# Altium schematic sheet Audio_Amplifier.SchDoc
size A; SheetNumber: 1; SheetTotal: 1
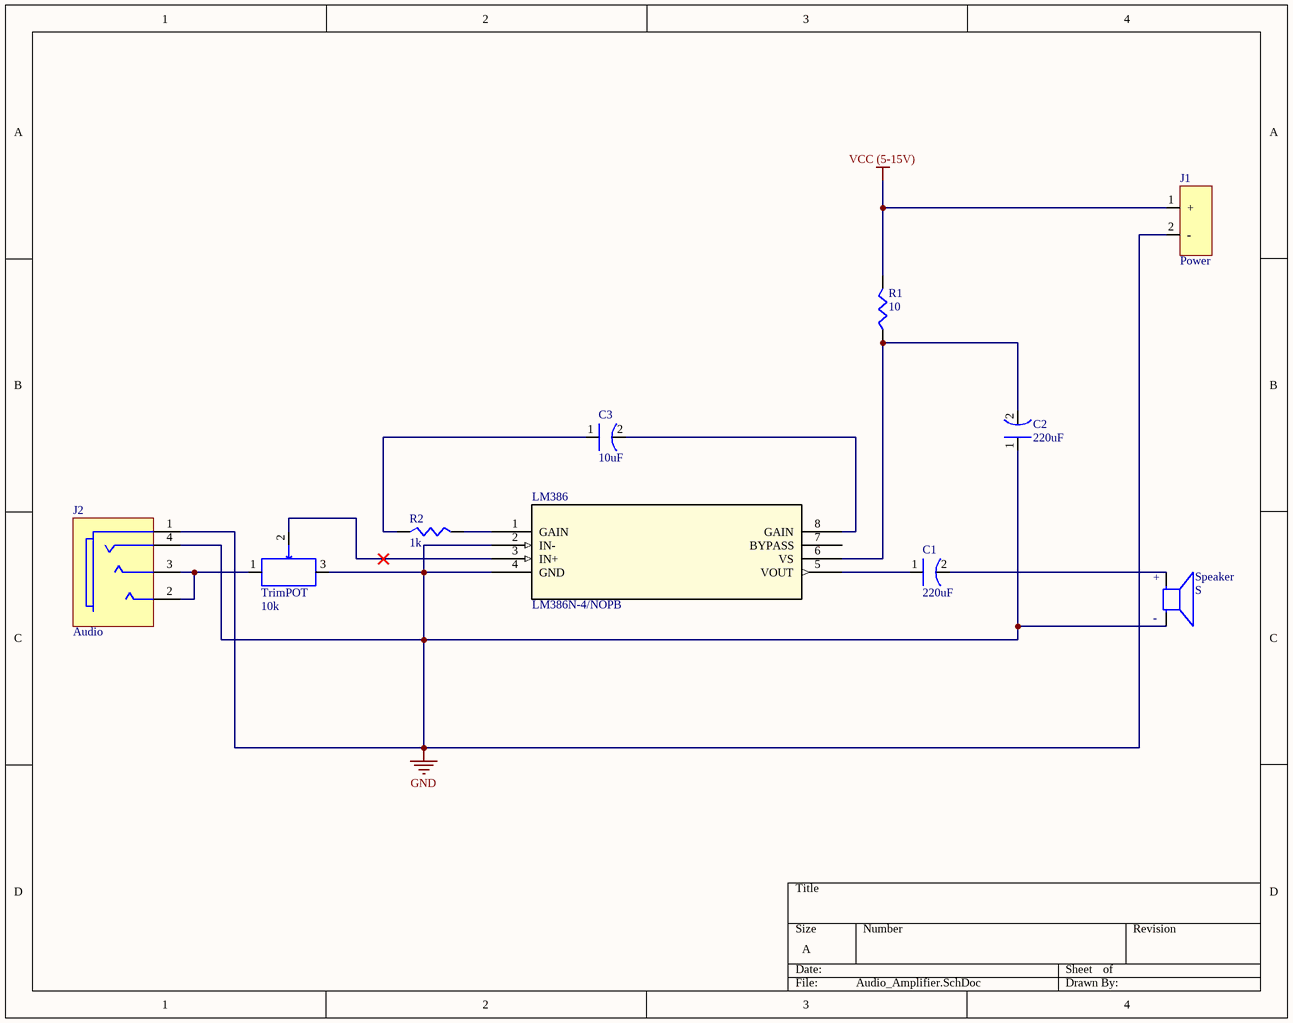
[diagram p0: Audio_Amplifier.SchDoc]

## Parts
C1  220uF  [CAP_YX_6P3X11_RUB]
C2  220uF  [CAP_YX_6P3X11_RUB]
C3  10uF  [CAP_YX_5X11_RUB]
J1  Power  [TE_2314870-2]
J2  Audio  [SAMESKY_SJ2-3574A-SMT-TR]
LM386  LM386N-4/NOPB  [N08E_TEX]
R1  10  [RES_OY_OHM]
R2  1k  [STA_CF14_STP]
Speaker  S  [SPKR_AST-03208MR-R]
TrimPOT  10k  [TRIM_3362P-1-103LF]

## Nets
GND: C2.1 J1.2(-) J2.1(sleeve) J2.4(ring_2) LM386.2(IN-) LM386.4(GND) Speaker.N(NEG) TrimPOT.3
VCC (5-15V): J1.1(+) R1.2
NetC1_1: C1.1 LM386.5(VOUT)
NetC1_2: C1.2 Speaker.P(POS)
NetC2_2: C2.2 LM386.6(VS) R1.1
NetC3_1: C3.1 R2.1
NetC3_2: C3.2 LM386.8(GAIN)
NetJ2_2: J2.2(tip) J2.3(ring_1) TrimPOT.1
NetLM386_1: LM386.1(GAIN) R2.2
NetLM386_3: LM386.3(IN+) TrimPOT.2

Not connected (* = marked no-connect by the designer): LM386 7(BYPASS)

## Notes on the sheet
- (in symbol AST-03208MR-R) +; -

## Library data of the parts
C1 C2 = 25YXJ220M6.3X11: CAP ALUM 220UF 20% 25V RADIAL TH; Manufacturer: Rubycon; Value: 220µF; Impedance: 220mΩ; Lead Diameter: 500µm; Leakage Current: 55µA; Life (Hours): 7000hours; Polarity: Polar; Ripple Current: 280mA; Supplier: DigiKey; Supplier Part Number: 1189-2913-ND; Manufacturer Part Number: 25YXJ220M6.3X11; RoHS: Compliant; Category: Aluminum Electrolytic Capacitors; Stock: 49998; Pricing: 1=0.3, 10=0.136, 50=0.1348, 100=0.1186, 500=0.09074, 2000=0.07456, 4000=0.06845, 6000=0.06536 (USD); Case/Package: Radial; Diameter: 6.3mm; Height: 11mm; Height - Seated (Max): 12.4968mm; Lead Pitch: 2.5mm; Length: 11mm; Lifecycle Status: Production; Max Operating Temperature: 105°C; Min Operating Temperature: -40°C; Mounting Technology: Through Hole; Number of Terminals: 2; Packaging: Bulk; Radiation Hardening: No; REACH SVHC: Yes; Terminal Pitch: 2.5mm; Termination: Radial; Tolerance: 20%; Voltage: 25V; Voltage Rating: 25V; Voltage Rating (DC): 25V; ComponentLink1URL: https://datasheet.octopart.com:443/25YXJ220M6.3X11-Rubycon-datasheet-182101243.pdf?src-supplier=IHS; ComponentLink1Description: https://datasheet.octopart.com:443/25YXJ220M6.3X11-Rubycon-datasheet-182101243.pdf?src-supplier=IHS; ComponentLink2URL: https://datasheet.octopart.com:443/25YXJ220M6.3X11-Rubycon-datasheet-86451563.pdf?src-supplier=Master+Electronics; ComponentLink2Description: https://datasheet.octopart.com:443/25YXJ220M6.3X11-Rubycon-datasheet-86451563.pdf?src-supplier=Master+Electronics; ComponentLink3URL: https://datasheet.octopart.com:443/25YXJ220M6.3X11-Rubycon-datasheet-155906921.pdf?src-supplier=JRH+Electronics; ComponentLink3Description: https://datasheet.octopart.com:443/25YXJ220M6.3X11-Rubycon-datasheet-155906921.pdf?src-supplier=JRH+Electronics; ComponentLink4URL: https://datasheet.octopart.com:443/25YXJ220M6.3X11-Rubycon-datasheet-12363446.pdf?src-supplier=Future+Electronics; ComponentLink4Description: https://datasheet.octopart.com:443/25YXJ220M6.3X11-Rubycon-datasheet-12363446.pdf?src-supplier=Future+Electronics
C3 = 50YXJ10M5X11: CAP ALUM 10UF 20% 50V RADIAL TH; Manufacturer: Rubycon; Value: 10µF; Impedance: 1.5Ω; Leakage Current: 5µA; Life (Hours): 5000hours; Ripple Current: 42mA; Supplier: DigiKey; Supplier Part Number: 1189-2322-ND; Manufacturer Part Number: 50YXJ10M5X11; RoHS: Compliant; Category: Aluminum Electrolytic Capacitors; Stock: 46663; Pricing: 1=0.29, 10=0.131, 50=0.1296, 100=0.1141, 500=0.08714, 1000=0.07859, 3000=0.0679, 6000=0.06259 (USD); Case/Package: Radial; Diameter: 5mm; Height: 11mm; Height - Seated (Max): 12.4968mm; Lead Free: Lead Free; Lead Pitch: 2.0066mm; Length: 11mm; Lifecycle Status: Production; Max Operating Temperature: 105°C; Min Operating Temperature: -40°C; Mounting Technology: Through Hole; Number of Terminals: 2; Packaging: Bulk; Radiation Hardening: No; REACH SVHC: Yes; Terminal Pitch: 2mm; Termination: Radial; Tolerance: 20%; Voltage Rating: 50V; Voltage Rating (DC): 50V; ComponentLink1URL: https://datasheet.octopart.com:443/50YXJ10M5X11-Rubycon-datasheet-182101243.pdf?src-supplier=IHS; ComponentLink1Description: https://datasheet.octopart.com:443/50YXJ10M5X11-Rubycon-datasheet-182101243.pdf?src-supplier=IHS; ComponentLink2URL: https://datasheet.octopart.com:443/50YXJ10M5X11-Rubycon-datasheet-12363446.pdf?src-supplier=Master+Electronics; ComponentLink2Description: https://datasheet.octopart.com:443/50YXJ10M5X11-Rubycon-datasheet-12363446.pdf?src-supplier=Master+Electronics; ComponentLink3URL: https://datasheet.octopart.com:443/50YXJ10M5X11-Rubycon-datasheet-155906921.pdf?src-supplier=JRH+Electronics; ComponentLink3Description: https://datasheet.octopart.com:443/50YXJ10M5X11-Rubycon-datasheet-155906921.pdf?src-supplier=JRH+Electronics
J1 = 2314870-2: 2P,2MM,BB,REC,SRVT,2.0,0.76AU,TU; Manufacturer: TE Connectivity / AMP; Circuit Application: Signal; Contact Current Rating: 2A; Contact Style: Socket; Dielectric Material: Liquid Crystal Polymer; Insulation Resistance: 1GΩ; Mating Alignment: Without; Number of Contacts: 2; Number of Ports: 1; Operating Supply Voltage: 125V; PCB Thickness: 1.6mm; Plating Thickness: 759.99848nm; Shielding: No; Supplier: DigiKey; Supplier Part Number: 17-2314870-2-ND; Manufacturer Part Number: 2314870-2; RoHS: Compliant; Category: Card Edge Connectors; Stock: 11381; Pricing: 1=0.72, 10=0.609, 110=0.51427, 550=0.45902, 1100=0.4371, 5060=0.39248, 10010=0.37405 (USD); China RoHS: Compliant; Contact Finish Thickness - Mating: 760nm; Contact Gender: Female; Current Rating: 2A; Housing Color: Black; Length: 4mm; Lifecycle Status: Production; Max Operating Temperature: 125°C; Min Operating Temperature: -40°C; Pins: 2; Number of Positions: 2; Number of Rows: 1; Orientation: Vertical; PCB Mount Alignment: Without; PCB Mount Retention: Without; REACH SVHC: Yes; Terminal Pitch: 2mm; Width: 2mm; ComponentLink1URL: https://datasheet.octopart.com:443/2314870-2-TE-Connectivity-datasheet-180034179.pdf?src-supplier=IHS; ComponentLink1Description: https://datasheet.octopart.com:443/2314870-2-TE-Connectivity-datasheet-180034179.pdf?src-supplier=IHS; ComponentLink2URL: https://datasheet.octopart.com:443/2314870-2-TE-Connectivity---AMP-datasheet-137291475.pdf?src-supplier=TE+Connectivity; ComponentLink2Description: https://datasheet.octopart.com:443/2314870-2-TE-Connectivity---AMP-datasheet-137291475.pdf?src-supplier=TE+Connectivity; ComponentLink3URL: https://sigma.octopart.com:443/137815737/technical_drawing/TE-Connectivity-2314870-2.pdf?src-supplier=TE+Connectivity; ComponentLink3Description: https://sigma.octopart.com:443/137815737/technical_drawing/TE-Connectivity-2314870-2.pdf?src-supplier=TE+Connectivity; ComponentLink4URL: https://datasheet.octopart.com:443/2314870-2-TE-Connectivity---AMP-datasheet-170291846.pdf?src-supplier=Master+Electronics; ComponentLink4Description: https://datasheet.octopart.com:443/2314870-2-TE-Connectivity---AMP-datasheet-170291846.pdf?src-supplier=Master+Electronics; ComponentLink5URL: https://datasheet.octopart.com:443/2314870-2-TE-Connectivity-datasheet-181565101.pdf?src-supplier=Sager+Electronics; ComponentLink5Description: https://datasheet.octopart.com:443/2314870-2-TE-Connectivity-datasheet-181565101.pdf?src-supplier=Sager+Electronics
J2 = SJ2-3574A-SMT-TR: AUDIO JACK, 3.5 MM, RT, 4 CONDUC; Manufacturer: CUI; Conn Orientation: Horizontal; Current Rating: 1A; Number Of Contacts: 4; Voltage Rating: 12V; Package: SJ2-3574A-SMT-TR; Device Class L1: Connectors; Lead Free: Yes; Digikey Description: AUDIO JACK, 3.5 MM, RT, 4 CONDUC; Device Class L2: Audio / Video Connectors; ComponentLink2URL: https://www.cui.com/product/resource/sj2-357x-smt.pdf; Automotive: No; RoHS: TRUE; Height: 5.3mm; Temperature Range Low: -25°C; Category: Conn; Temperature: -25°C to +85°C; Octopart: https://octopart.com/sj2-3574a-smt-tr-cui-77838840; Device Class L3: unset; Contact Material: Silver; Manufacturer Part Number: SJ2-3574A-SMT-TR; Temperature Range High: +85°C; ComponentLink2Description: Datasheet
LM386 = LM386N-4/NOPB: IC AMP CLASS AB MONO 1W 8DIP; Manufacturer: Texas Instruments; Manufacturer Lifecycle Status: ACTIVE; Bandwidth: 300kHz; Gain: 20dB; Input Bias Current: 250nA; Load Impedance: 8Ω; Max Power Dissipation: 1.25W; Max Supply Voltage: 18V; Min Supply Voltage: 5V; Nominal Supply Current: 4mA; Number of Channels: 1; Operating Supply Voltage: 12V; Power Supply Rejection Ratio (PSRR): 50dB; Supply Type: Single; Voltage Gain: 46dB; Supplier: DigiKey; Supplier Part Number: 296-43960-5-ND; Manufacturer Part Number: LM386N-4/NOPB; RoHS: Compliant; Category: Amplifiers - Audio; Stock: 3854; Pricing: 1=1.05, 10=0.757, 40=0.6525, 120=0.59425, 280=0.56014, 520=0.53985, 1000=0.52192, 2520=0.5016, 5000=0.48959 (USD); Case/Package: PDIP; Contact Plating: Tin; Height: 5.08mm; Lead Free: Lead Free; Length: 9.81mm; Lifecycle Status: Production; Max Operating Temperature: 70°C; Max Output Power: 1W; Min Operating Temperature: 0°C; Pins: 8; Output Power: 1W; Power Dissipation: 1.25W; Quiescent Current: 4mA; Radiation Hardening: No; REACH SVHC: No; Schedule B: 8542330000, 8542330000|8542330000|8542330000|8542330000|8542330000; Thickness: 3.9mm; Weight: 4.535924g; Width: 6.35mm; ComponentLink1URL: https://octopart.com:443/opatz8j6/c1?t=jiPaMZP2rnyQg5DzUUspGXJ1H81nn_meodlJxaU5rnmp5Nz2ANkFOJjw4AMPM17dABOurUYLs7Oiea1cG9Dp3V3kRsJ43gYboc5MRNM_wXx_hdbyhUPu1cwRkgSQnbMDrTSRuBGe7vuZ52zUPxv4RYMfxCTIfcL-Gs1LHG8EJfKQca_ABSS6-7HJh27p74ambnRZQ_xhmEf-5hRXq6kXlRxXTde8jlB9apxAIESCEWDl4004FjcawcWp2VDcw49HMZT9NKZB0TSbyNArSrQo-COYzUjjGeFKa-94cvLja9jANuMpPI5KLd_4xSjywMOucovxXtGr6NT1M1bIYcylWYcDOz6hqSDLVAehd2HyIxJaoHqn7yOvszgqGYrjaQdrIEmJ&src-supplier=Texas+Instruments; ComponentLink1Description: https://octopart.com:443/opatz8j6/c1?t=jiPaMZP2rnyQg5DzUUspGXJ1H81nn_meodlJxaU5rnmp5Nz2ANkFOJjw4AMPM17dABOurUYLs7Oiea1cG9Dp3V3kRsJ43gYboc5MRNM_wXx_hdbyhUPu1cwRkgSQnbMDrTSRuBGe7vuZ52zUPxv4RYMfxCTIfcL-Gs1LHG8EJfKQca_ABSS6-7HJh27p74ambnRZQ_xhmEf-5hRXq6kXlRxXTde8jlB9apxAIESCEWDl4004FjcawcWp2VDcw49HMZT9NKZB0TSbyNArSrQo-COYzUjjGeFKa-94cvLja9jANuMpPI5KLd_4xSjywMOucovxXtGr6NT1M1bIYcylWYcDOz6hqSDLVAehd2HyIxJaoHqn7yOvszgqGYrjaQdrIEmJ&src-supplier=Texas+Instruments; ComponentLink2URL: https://sigma.octopart.com:443/49250158/technical_drawing/Texas-Instruments-LM386N-4-NOPB.pdf?src-supplier=Texas+Instruments; ComponentLink2Description: https://sigma.octopart.com:443/49250158/technical_drawing/Texas-Instruments-LM386N-4-NOPB.pdf?src-supplier=Texas+Instruments; ComponentLink3URL: https://datasheet.octopart.com:443/LM386N-4-NOPB-Texas-Instruments-datasheet-94062099.pdf?src-supplier=Upverter; ComponentLink3Description: https://datasheet.octopart.com:443/LM386N-4-NOPB-Texas-Instruments-datasheet-94062099.pdf?src-supplier=Upverter; ComponentLink4URL: https://datasheet.octopart.com:443/LM386N-4/NOPB-Texas-Instruments-datasheet-10848518.pdf?src-supplier=element14; ComponentLink4Description: https://datasheet.octopart.com:443/LM386N-4/NOPB-Texas-Instruments-datasheet-10848518.pdf?src-supplier=element14; ComponentLink5URL: https://datasheet.octopart.com:443/LM386N-4/NOPB-National-Semiconductor-datasheet-11093.pdf?src-supplier=element14; ComponentLink5Description: https://datasheet.octopart.com:443/LM386N-4/NOPB-National-Semiconductor-datasheet-11093.pdf?src-supplier=element14; ComponentLink6URL: https://datasheet.octopart.com:443/LM386N-4-NOPB-Texas-Instruments-datasheet-164415079.pdf?src-supplier=SHENGYU+ELECTRONICS; ComponentLink6Description: https://datasheet.octopart.com:443/LM386N-4-NOPB-Texas-Instruments-datasheet-164415079.pdf?src-supplier=SHENGYU+ELECTRONICS; ComponentLink7URL: https://datasheet.octopart.com:443/LM386N-4-NOPB-Texas-Instruments-datasheet-159115206.pdf?src-supplier=LCSC; ComponentLink7Description: https://datasheet.octopart.com:443/LM386N-4-NOPB-Texas-Instruments-datasheet-159115206.pdf?src-supplier=LCSC; ComponentLink8URL: https://datasheet.octopart.com:443/LM386N-4/NOPB-National-Semiconductor-datasheet-9929271.pdf?src-supplier=RS+(Formerly+Allied+Electronics); ComponentLink8Description: https://datasheet.octopart.com:443/LM386N-4/NOPB-National-Semiconductor-datasheet-9929271.pdf?src-supplier=RS+(Formerly+Allied+Electronics); ComponentLink9URL: https://datasheet.octopart.com:443/LM386N-4-NOPB-Texas-Instruments-datasheet-8817787.pdf?src-supplier=Jameco; ComponentLink9Description: https://datasheet.octopart.com:443/LM386N-4-NOPB-Texas-Instruments-datasheet-8817787.pdf?src-supplier=Jameco; ComponentLink10URL: http://sigma.octopart.com:80/conflict_mineral_statement/Texas-Instruments-company-63.pdf?src-supplier=Compliance+Statements; ComponentLink10Description: http://sigma.octopart.com:80/conflict_mineral_statement/Texas-Instruments-company-63.pdf?src-supplier=Compliance+Statements; ComponentLink11URL: http://sigma.octopart.com:80/reach_statement/Texas-Instruments-company-64.pdf?src-supplier=Compliance+Statements; ComponentLink11Description: http://sigma.octopart.com:80/reach_statement/Texas-Instruments-company-64.pdf?src-supplier=Compliance+Statements
R1 = OY100KE: RES 10 OHM 10% 2W AXIAL; Manufacturer: Ohmite; Lead Diameter: 800µm; Lead Length: 38mm; Value: 10Ω; Temperature Coefficient: 1600ppm/°C; Voltage Rating: 400V; Wire/Cable Diameter: 787.4µm; Supplier: DigiKey; Supplier Part Number: OY100KE-ND; Manufacturer Part Number: OY100KE; RoHS: Compliant; Category: Through-Hole Resistors; Stock: 6509; Pricing: 1=3.32, 10=2.226, 25=1.9292, 50=1.7438, 100=1.5859, 250=1.41308, 500=1.30492, 1000=1.21304, 5000=1.04961 (USD); Case/Package: Axial; Composition: Ceramic; Diameter: 7mm; Features: Moisture Resistant; Lead Free: Lead Free; Length: 18.9992mm; Lifecycle Status: Production; Material: Ceramic; Max Operating Temperature: 220°C; Max Power Dissipation: 2W; Min Operating Temperature: -40°C; Mounting Technology: Through Hole; Pins: 2; Number of Terminals: 2; Number of Terminations: 2; Packaging: Bulk; Power Dissipation: 2W; Power Rating: 2W; REACH SVHC: Yes; Termination: Axial; Tolerance: 10%; Voltage Rating (AC): 400V; Voltage Rating (DC): 400V; Working Voltage: 400V; ComponentLink1URL: https://datasheet.octopart.com:443/OY100KE-Ohmite-datasheet-10289479.pdf?src-supplier=Master+Electronics; ComponentLink1Description: https://datasheet.octopart.com:443/OY100KE-Ohmite-datasheet-10289479.pdf?src-supplier=Master+Electronics; ComponentLink2URL: https://datasheet.octopart.com:443/OY100KE-Ohmite-datasheet-118803.pdf?src-supplier=Newark; ComponentLink2Description: https://datasheet.octopart.com:443/OY100KE-Ohmite-datasheet-118803.pdf?src-supplier=Newark; ComponentLink3URL: https://datasheet.octopart.com:443/OY100KE-Ohmite-datasheet-8757895.pdf?src-supplier=Newark; ComponentLink3Description: https://datasheet.octopart.com:443/OY100KE-Ohmite-datasheet-8757895.pdf?src-supplier=Newark; ComponentLink4URL: https://datasheet.octopart.com:443/OY100KE-Ohmite-datasheet-8449861.pdf?src-supplier=Newark; ComponentLink4Description: https://datasheet.octopart.com:443/OY100KE-Ohmite-datasheet-8449861.pdf?src-supplier=Newark; ComponentLink5URL: https://datasheet.octopart.com:443/OY100KE-Ohmite-datasheet-65987458.pdf?src-supplier=Electro+Sonic; ComponentLink5Description: https://datasheet.octopart.com:443/OY100KE-Ohmite-datasheet-65987458.pdf?src-supplier=Electro+Sonic; ComponentLink6URL: https://datasheet.octopart.com:443/OY100KE-Ohmite-datasheet-156071680.pdf?src-supplier=Electro+Sonic; ComponentLink6Description: https://datasheet.octopart.com:443/OY100KE-Ohmite-datasheet-156071680.pdf?src-supplier=Electro+Sonic; ComponentLink7URL: https://datasheet.octopart.com:443/OY100KE-Ohmite-datasheet-27849301.pdf?src-supplier=Electro+Sonic; ComponentLink7Description: https://datasheet.octopart.com:443/OY100KE-Ohmite-datasheet-27849301.pdf?src-supplier=Electro+Sonic; ComponentLink8URL: https://datasheet.octopart.com:443/OY100KE-Ohmite-datasheet-37140018.pdf?src-supplier=Farnell; ComponentLink8Description: https://datasheet.octopart.com:443/OY100KE-Ohmite-datasheet-37140018.pdf?src-supplier=Farnell; ComponentLink9URL: https://datasheet.octopart.com:443/OY100KE-Ohmite-datasheet-3744.pdf?src-supplier=RS+(Formerly+Allied+Electronics); ComponentLink9Description: https://datasheet.octopart.com:443/OY100KE-Ohmite-datasheet-3744.pdf?src-supplier=RS+(Formerly+Allied+Electronics)
R2 = CF14JT1K00: RES 1K OHM 5% 1/4W AXIAL; Manufacturer: Stackpole Electronics; Lead Diameter: 550µm; Lead Length: 28mm; Max Power Dissipation: 250mW; Value: 1kΩ; Temperature Coefficient: -400ppm/°C; Working Voltage: 350V; Supplier: DigiKey; Supplier Part Number: CF14JT1K00CT-ND; Manufacturer Part Number: CF14JT1K00; RoHS: Compliant; Category: Through-Hole Resistors; Stock: 403693; Pricing: 1=0.1, 10=0.026, 25=0.022, 50=0.0192, 100=0.0169, 250=0.01424, 500=0.0126, 1000=0.0112 (USD); Case/Package: Axial; China RoHS: Compliant; Composition: Carbon Film; Contact Plating: Tin; Diameter: 2.3mm; Features: Flame Retardant Coating; Lead Free: Lead Free; Length: 6.5mm; Lifecycle Status: Production; Max Operating Temperature: 155°C; Military Standard: Not; Min Operating Temperature: -55°C; Mounting Technology: Axial, Through Hole; Number of Terminals: 2; Number of Terminations: 2; Packaging: Tape & Reel (TR); Power Dissipation: 250mW; Power Rating: 250mW; Radiation Hardening: No; REACH SVHC: Yes; Schedule B: 8533100070, 8533100070|8533100070|8533100070|8533100070|8533100070; Termination: Axial; Tolerance: 5%; ComponentLink1URL: https://datasheet.octopart.com:443/CF14JT1K00-Stackpole-Electronics-datasheet-170576565.pdf?src-supplier=IHS; ComponentLink1Description: https://datasheet.octopart.com:443/CF14JT1K00-Stackpole-Electronics-datasheet-170576565.pdf?src-supplier=IHS; ComponentLink2URL: https://datasheet.octopart.com:443/CF14JT1K00-Stackpole-Electronics-datasheet-32780772.pdf?src-supplier=Electro+Sonic; ComponentLink2Description: https://datasheet.octopart.com:443/CF14JT1K00-Stackpole-Electronics-datasheet-32780772.pdf?src-supplier=Electro+Sonic; ComponentLink3URL: https://datasheet.octopart.com:443/CF14JT1K00-Stackpole-Electronics-datasheet-141193785.pdf?src-supplier=Upverter; ComponentLink3Description: https://datasheet.octopart.com:443/CF14JT1K00-Stackpole-Electronics-datasheet-141193785.pdf?src-supplier=Upverter; ComponentLink4URL: https://datasheet.octopart.com:443/CF14JT1K00-Stackpole-Electronics-datasheet-12509918.pdf?src-supplier=Stackpole+Electronics; ComponentLink4Description: https://datasheet.octopart.com:443/CF14JT1K00-Stackpole-Electronics-datasheet-12509918.pdf?src-supplier=Stackpole+Electronics; ComponentLink5URL: https://datasheet.octopart.com:443/CF14JT1K00-Stackpole-Electronics-datasheet-10790057.pdf?src-supplier=Stackpole+Electronics; ComponentLink5Description: https://datasheet.octopart.com:443/CF14JT1K00-Stackpole-Electronics-datasheet-10790057.pdf?src-supplier=Stackpole+Electronics; ComponentLink6URL: https://datasheet.octopart.com:443/CF14JT1K00-Stackpole-Electronics-datasheet-8360004.pdf?src-supplier=Future+Electronics; ComponentLink6Description: https://datasheet.octopart.com:443/CF14JT1K00-Stackpole-Electronics-datasheet-8360004.pdf?src-supplier=Future+Electronics; ComponentLink7URL: https://datasheet.octopart.com:443/CF14JT1K00-Stackpole-Electronics-datasheet-5314120.pdf?src-supplier=Future+Electronics; ComponentLink7Description: https://datasheet.octopart.com:443/CF14JT1K00-Stackpole-Electronics-datasheet-5314120.pdf?src-supplier=Future+Electronics; ComponentLink8URL: https://datasheet.octopart.com:443/CF14JT1K00-Stackpole-Electronics-datasheet-8325406.pdf?src-supplier=Future+Electronics; ComponentLink8Description: https://datasheet.octopart.com:443/CF14JT1K00-Stackpole-Electronics-datasheet-8325406.pdf?src-supplier=Future+Electronics; ComponentLink9URL: https://datasheet.octopart.com:443/CF14JT1K00-Stackpole-Electronics-datasheet-502449.pdf?src-supplier=Future+Electronics; ComponentLink9Description: https://datasheet.octopart.com:443/CF14JT1K00-Stackpole-Electronics-datasheet-502449.pdf?src-supplier=Future+Electronics; ComponentLink10URL: https://datasheet.octopart.com:443/CF14JT1K00-Stackpole-Electronics-datasheet-11550139.pdf?src-supplier=Arrow+Electronics; ComponentLink10Description: https://datasheet.octopart.com:443/CF14JT1K00-Stackpole-Electronics-datasheet-11550139.pdf?src-supplier=Arrow+Electronics; ComponentLink11URL: https://datasheet.octopart.com:443/CF14JT1K00-Stackpole-Electronics-datasheet-11549048.pdf?src-supplier=Arrow+Electronics; ComponentLink11Description: https://datasheet.octopart.com:443/CF14JT1K00-Stackpole-Electronics-datasheet-11549048.pdf?src-supplier=Arrow+Electronics; ComponentLink12URL: http://sigma.octopart.com:80/15940385/materials_sheet/Stackpole-Electronics-CF14JT1K00.pdf?src-supplier=Compliance+Statements; ComponentLink12Description: http://sigma.octopart.com:80/15940385/materials_sheet/Stackpole-Electronics-CF14JT1K00.pdf?src-supplier=Compliance+Statements; ComponentLink13URL: http://sigma.octopart.com:80/141158212/rohs_statement/Stackpole-Electronics-CF14JT1K00.pdf?src-supplier=Compliance+Statements; ComponentLink13Description: http://sigma.octopart.com:80/141158212/rohs_statement/Stackpole-Electronics-CF14JT1K00.pdf?src-supplier=Compliance+Statements; ComponentLink14URL: http://sigma.octopart.com:80/141158211/reach_statement/Stackpole-Electronics-CF14JT1K00.pdf?src-supplier=Compliance+Statements; ComponentLink14Description: http://sigma.octopart.com:80/141158211/reach_statement/Stackpole-Electronics-CF14JT1K00.pdf?src-supplier=Compliance+Statements
Speaker = AST-03208MR-R: SPEAKER 8OHM 100MW TOP PORT 82DB; Manufacturer: PUI Audio; Frequency: 20kHz; Impedance: 8Ω; Max Power Dissipation: 200mW; Self Resonant Frequency: 1.5kHz; Shape: Round; Supplier: DigiKey; Supplier Part Number: 668-1139-ND; Manufacturer Part Number: AST-03208MR-R; RoHS: Compliant; Category: Speakers; Stock: 447; Pricing: 1=3.07, 10=2.414, 25=2.1984, 50=2.0502, 100=1.9135, 250=1.74888, 500=1.6354, 1000=1.53058, 5000=1.525 (USD); Depth: 15.1mm; Diameter: 31.9mm; Height: 15.1mm; Lead Free: Lead Free; Max Operating Temperature: 60°C; Min Operating Temperature: -20°C; Mounting Technology: Through Hole; Packaging: Bulk; Power Rating: 100mW; REACH SVHC: Yes; Termination: PC Pins; ComponentLink1URL: https://datasheet.octopart.com:443/AST-03208MR-R-PUI-Audio-datasheet-10519845.pdf?src-supplier=element14+APAC; ComponentLink1Description: https://datasheet.octopart.com:443/AST-03208MR-R-PUI-Audio-datasheet-10519845.pdf?src-supplier=element14+APAC; ComponentLink2URL: https://datasheet.octopart.com:443/AST-03208MR-R-PUI-Audio-datasheet-8776228.pdf?src-supplier=element14+APAC; ComponentLink2Description: https://datasheet.octopart.com:443/AST-03208MR-R-PUI-Audio-datasheet-8776228.pdf?src-supplier=element14+APAC; ComponentLink3URL: https://datasheet.octopart.com:443/AST-03208MR-R-Projects-Unlimited-datasheet-7562446.pdf?src-supplier=element14; ComponentLink3Description: https://datasheet.octopart.com:443/AST-03208MR-R-Projects-Unlimited-datasheet-7562446.pdf?src-supplier=element14; ComponentLink4URL: https://datasheet.octopart.com:443/AST-03208MR-R-PUI-Audio-datasheet-154249236.pdf?src-supplier=Sager+Electronics; ComponentLink4Description: https://datasheet.octopart.com:443/AST-03208MR-R-PUI-Audio-datasheet-154249236.pdf?src-supplier=Sager+Electronics; ComponentLink5URL: https://datasheet.octopart.com:443/AST-03208MR-R-Projects-Unlimited-datasheet-15957.pdf?src-supplier=Newark; ComponentLink5Description: https://datasheet.octopart.com:443/AST-03208MR-R-Projects-Unlimited-datasheet-15957.pdf?src-supplier=Newark
TrimPOT = 3362P-1-103LF: TRIMMER 10K OHM 0.5W PC PIN TOP; Manufacturer: Bourns; Insulation Resistance: 1GΩ; Lead Diameter: 460µm; Lead Length: 5.46mm; Max Power Dissipation: 500mW; Number of Turns: 1; Pitch: 2.54mm; Power Rating: 1W; Value: 10kΩ; Temperature Coefficient: 100ppm/°C; Tolerance: 10%; Voltage Rating: 220mV; Voltage Rating (AC): 300V; Supplier: DigiKey; Supplier Part Number: 3362P-103LF-ND; Manufacturer Part Number: 3362P-1-103LF; RoHS: Compliant; Category: Variable Resistors and Potentiometers; Stock: 10636; Pricing: 1=0.91, 10=0.765, 25=0.714, 50=0.6778, 100=0.6432, 250=0.5998, 500=0.56882, 1000=0.53931, 5000=0.47625 (USD); Case/Package: Radial; Case Code (Imperial): 0612; Case Code (Metric): 1632; Color: Blue; Composition: Cermet; Contact Plating: Tin; Depth: 6.99mm; Height: 4.88mm; Lead Free: Lead Free; Length: 3.2mm; Lifecycle Status: Production; Max Operating Temperature: 125°C; Military Standard: Not; Min Operating Temperature: -55°C; Mounting Technology: Surface Mount; Pins: 3; Number of Terminals: 3; Packaging: Tape and Reel; Power Dissipation: 500mW; Radiation Hardening: No; REACH SVHC: Yes; Schedule B: 8533400080, 8533400080|8533400080|8533400080|8533400080|8533400080; Taper: Linear; Termination: Pin; Type: Potentiometer; Voltage Rating (DC): 300V; Weight: 566.990462mg; Width: 6.6mm; Working Voltage: 300V; ComponentLink1URL: https://datasheet.octopart.com:443/3362P-1-103LF-Bourns-datasheet-182141429.pdf?src-supplier=IHS; ComponentLink1Description: https://datasheet.octopart.com:443/3362P-1-103LF-Bourns-datasheet-182141429.pdf?src-supplier=IHS; ComponentLink2URL: https://datasheet.octopart.com:443/3362P-1-103LF-Bourns-datasheet-134530169.pdf?src-supplier=Upverter; ComponentLink2Description: https://datasheet.octopart.com:443/3362P-1-103LF-Bourns-datasheet-134530169.pdf?src-supplier=Upverter; ComponentLink3URL: https://datasheet.octopart.com:443/3362P-1-103LF-Bourns-datasheet-8815966.pdf?src-supplier=Electro+Sonic; ComponentLink3Description: https://datasheet.octopart.com:443/3362P-1-103LF-Bourns-datasheet-8815966.pdf?src-supplier=Electro+Sonic; ComponentLink4URL: https://datasheet.octopart.com:443/3362P-1-103LF-Bourns-datasheet-154729579.pdf?src-supplier=Electro+Sonic; ComponentLink4Description: https://datasheet.octopart.com:443/3362P-1-103LF-Bourns-datasheet-154729579.pdf?src-supplier=Electro+Sonic; ComponentLink5URL: https://datasheet.octopart.com:443/3362P-1-103LF-Bourns-datasheet-67878644.pdf?src-supplier=Newark; ComponentLink5Description: https://datasheet.octopart.com:443/3362P-1-103LF-Bourns-datasheet-67878644.pdf?src-supplier=Newark; ComponentLink6URL: https://datasheet.octopart.com:443/3362P-1-103LF-Bourns-datasheet-5314783.pdf?src-supplier=Factory+Futures; ComponentLink6Description: https://datasheet.octopart.com:443/3362P-1-103LF-Bourns-datasheet-5314783.pdf?src-supplier=Factory+Futures; ComponentLink7URL: https://datasheet.octopart.com:443/3362P-1-103LF-Bourns-datasheet-8765802.pdf?src-supplier=Factory+Futures; ComponentLink7Description: https://datasheet.octopart.com:443/3362P-1-103LF-Bourns-datasheet-8765802.pdf?src-supplier=Factory+Futures; ComponentLink8URL: https://datasheet.octopart.com:443/3362P-1-103LF-Bourns-datasheet-25360172.pdf?src-supplier=RS+(Formerly+Allied+Electronics); ComponentLink8Description: https://datasheet.octopart.com:443/3362P-1-103LF-Bourns-datasheet-25360172.pdf?src-supplier=RS+(Formerly+Allied+Electronics); ComponentLink9URL: https://datasheet.octopart.com:443/3362P-1-103LF-Bourns-datasheet-1143.pdf?src-supplier=RS+(Formerly+Allied+Electronics); ComponentLink9Description: https://datasheet.octopart.com:443/3362P-1-103LF-Bourns-datasheet-1143.pdf?src-supplier=RS+(Formerly+Allied+Electronics); ComponentLink10URL: https://datasheet.octopart.com:443/3362P-1-103LF-Bourns-datasheet-10270.pdf?src-supplier=RS+(Formerly+Allied+Electronics); ComponentLink10Description: https://datasheet.octopart.com:443/3362P-1-103LF-Bourns-datasheet-10270.pdf?src-supplier=RS+(Formerly+Allied+Electronics); ComponentLink11URL: https://datasheet.octopart.com:443/3362P-1-103LF-Bourns-datasheet-21196235.pdf?src-supplier=Burklin+Elektronik; ComponentLink11Description: https://datasheet.octopart.com:443/3362P-1-103LF-Bourns-datasheet-21196235.pdf?src-supplier=Burklin+Elektronik; ComponentLink12URL: https://datasheet.octopart.com:443/3362P-1-103LF-Bourns-datasheet-177039047.pdf?src-supplier=Burklin+Elektronik; ComponentLink12Description: https://datasheet.octopart.com:443/3362P-1-103LF-Bourns-datasheet-177039047.pdf?src-supplier=Burklin+Elektronik; ComponentLink13URL: https://datasheet.octopart.com:443/3362P-1-103LF-Bourns-datasheet-16887701.pdf?src-supplier=Farnell; ComponentLink13Description: https://datasheet.octopart.com:443/3362P-1-103LF-Bourns-datasheet-16887701.pdf?src-supplier=Farnell; ComponentLink14URL: https://datasheet.octopart.com:443/3362P-1-103LF-Bourns-datasheet-14175342.pdf?src-supplier=iiiC; ComponentLink14Description: https://datasheet.octopart.com:443/3362P-1-103LF-Bourns-datasheet-14175342.pdf?src-supplier=iiiC; ComponentLink15URL: https://datasheet.octopart.com:443/3362P-1-103LF-Bourns-datasheet-8361975.pdf?src-supplier=Verical; ComponentLink15Description: https://datasheet.octopart.com:443/3362P-1-103LF-Bourns-datasheet-8361975.pdf?src-supplier=Verical; ComponentLink16URL: https://datasheet.octopart.com:443/3362P-1-103LF-Bourns-datasheet-7621470.pdf?src-supplier=Jameco; ComponentLink16Description: https://datasheet.octopart.com:443/3362P-1-103LF-Bourns-datasheet-7621470.pdf?src-supplier=Jameco; ComponentLink17URL: http://sigma.octopart.com:80/conflict_mineral_statement/Bourns-company-36.pdf?src-supplier=Compliance+Statements; ComponentLink17Description: http://sigma.octopart.com:80/conflict_mineral_statement/Bourns-company-36.pdf?src-supplier=Compliance+Statements